# Altium schematic sheet v1.0.SchDoc
size 76 x 27 mm
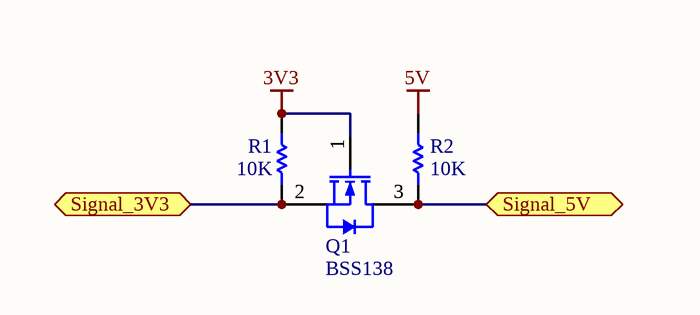
[diagram p0: v1.0.SchDoc]

## Parts
Q1  BSS138  [SOT23_3PIN]
R1  10K  [SMD_0805]
R2  10K  [SMD_0805]

## Ports
Signal_3V3 (bidir), Signal_5V (bidir)

## Nets
3V3: Q1.1(G) R1.1
5V: R2.2
Signal_3V3: Q1.2(S) R1.2 ; port Signal_3V3
Signal_5V: Q1.3(D) R2.1 ; port Signal_5V

## Library data of the parts
Q1 = Transistor_MOSFET_N-Channel_3Type
R1 R2 = Resistor: Resistor, 1/4W, 5%; Revision: July-2002: Re-released for DXP Platform.